# EAGLE design radencoder_links (EAGLE 7.6.0)
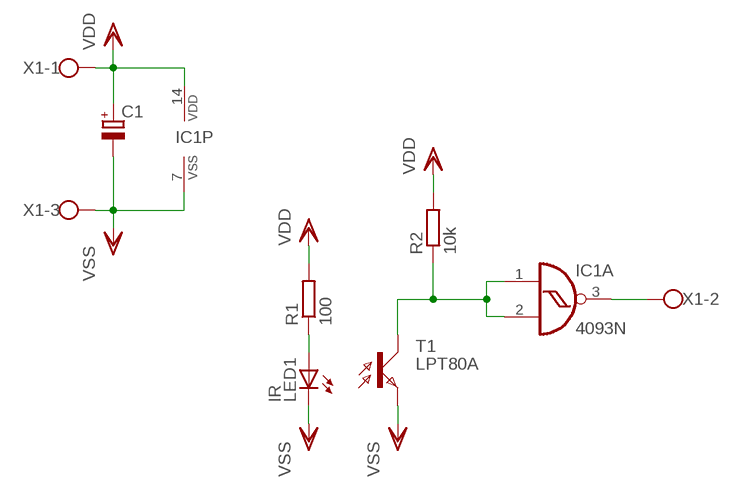
[diagram p0: schematic, sheet 1]

## Parts
C1  CPOL-EUE5-10.5  [E5-10,5]
IC1  4093N  [DIL14]
LED1  IR  LED5MM  [LED5MM]
R1  100  R-EU_0207/10  [0207/10]
R2  10k  R-EU_0207/10  [0207/10]
T1  LPT80A  [LPT80A]
X1  W237-103  [W237-103]

## Nets
N$1: IC1.3(A:O) X1.2
N$2: IC1.1(A:I0) IC1.2(A:I1) R2.1 T1.C
N$5: LED1.A R1.1
VDD: C1.+ IC1.14(P:VDD) R1.2 R2.2 X1.1
VSS: C1.- IC1.7(P:VSS) LED1.K(C) T1.E X1.3
Unconnected: IC1.4(B:O) IC1.5(B:I0) IC1.6(B:I1) IC1.8(C:I0) IC1.9(C:I1) IC1.10(C:O) IC1.11(D:O) IC1.12(D:I0) IC1.13(D:I1)

## Library data of the parts
C1 = resistor:CPOL-EU: POLARIZED CAPACITOR, European symbol
IC1 = 40xx:4093: Quad 2-input NAND schmitt trigger
LED1 = led:LED: LED OSRAM: - CHIPLED LG R971, LG N971, LY N971, LG Q971, LY Q971, LO R971, LY R971 LH N974, LH R974 LS Q976, LO Q976, LY Q976 LO Q996 - Hyper CHIPLED LW Q18S LB Q993, LB Q99A, LB R99A - SideLED LS A670, LO A670, LY A670, LG A670, LP A670 LB A673, LV A673, LT A673, LW A673 LH A674 LY A675 LS A676, LA A676, LO A676, LY A676, LW A676 LS A679, LY A679, LG A679 - Hyper Micro SIDELED® LS Y876, LA Y876, LO Y876, LY Y876 LT Y87S - SmartLED LW L88C, LW L88S LB L89C, LB L89S, LG L890 LS L89K, LO L89K, LY L89K LS L896, LA L896, LO L896, LY L896 - TOPLED LS T670, LO T670, LY T670, LG T670, LP T670 LSG T670, LSP T670, LSY T670, LOP T670, LYG T670 LG T671, LOG T671, LSG T671 LB T673, LV T673, LT T673, LW T673 LH T674 LS T676, LA T676, LO T676, LY T676, LB T676, LH T676, LSB T676, LW T676 LB T67C, LV T67C, LT T67C, LS T67K, LO T67K, LY T67K, LW E67C LS E67B, LA E67B, LO E67B, LY E67B, LB E67C, LV E67C, LT E67C LW T67C LS T679, LY T679, LG T679 LS T770, LO T770, LY T770, LG T770, LP T770 LB T773, LV T773, LT T773, LW T773 LH T774 LS E675, LA E675, LY E675, LS T675 LS T776, LA T776, LO T776, LY T776, LB T776 LHGB T686 LT T68C, LB T68C - Hyper Mini TOPLED® LB M676 - Mini TOPLED Santana® LG M470 LS M47K, LO M47K, LY M47K Source: http://www.osram.convergy.de LUXEON: - LUMILED® LXK2-PW12-R00, LXK2-PW12-S00, LXK2-PW14-U00, LXK2-PW14-V00 LXK2-PM12-R00, LXK2-PM12-S00, LXK2-PM14-U00 LXK2-PE12-Q00, LXK2-PE12-R00, LXK2-PE12-S00, LXK2-PE14-T00, LXK2-PE14-U00 LXK2-PB12-K00, LXK2-PB12-L00, LXK2-PB12-M00, LXK2-PB14-N00, LXK2-PB14-P00, LXK2-PB14-Q00 LXK2-PR12-L00, LXK2-PR12-M00, LXK2-PR14-Q00, LXK2-PR14-R00 LXK2-PD12-Q00, LXK2-PD12-R00, LXK2-PD12-S00 LXK2-PH12-R00, LXK2-PH12-S00 LXK2-PL12-P00, LXK2-PL12-Q00, LXK2-PL12-R00 Source: www.luxeon.com KINGBRIGHT: KA-3528ASYC Source: www.kingbright.com
R1 R2 = rcl:R-EU_: RESISTOR, European symbol
T1 = opto-trans-siemens:LPT80A: PHOTO TRANSISTOR; OC_FARNELL: unknown; OC_NEWARK: unknown
X1 = con-wago-500:W237-103: WAGO SCREW CLAMP; MPN: 237-103; OC_FARNELL: unknown; OC_NEWARK: 18M7116

## Board
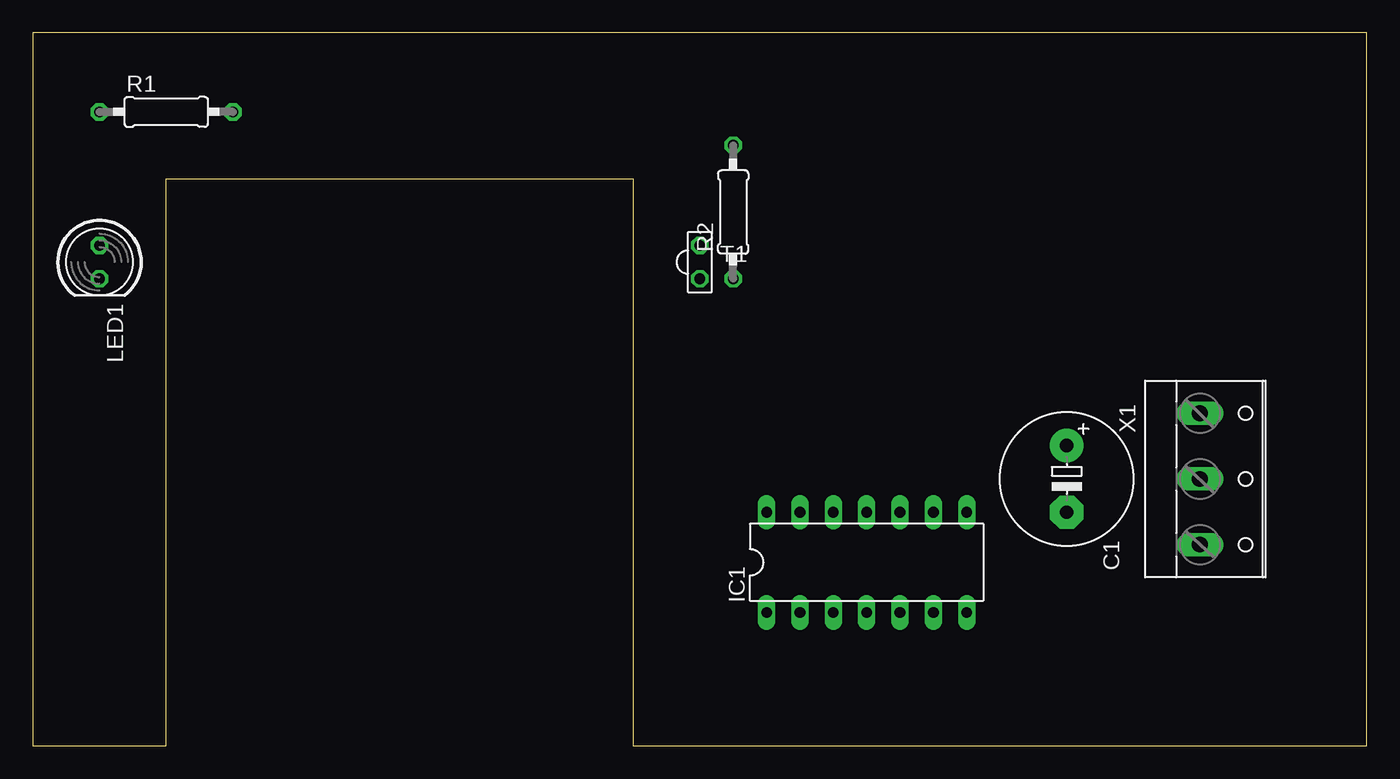
[diagram p1: board, top side]
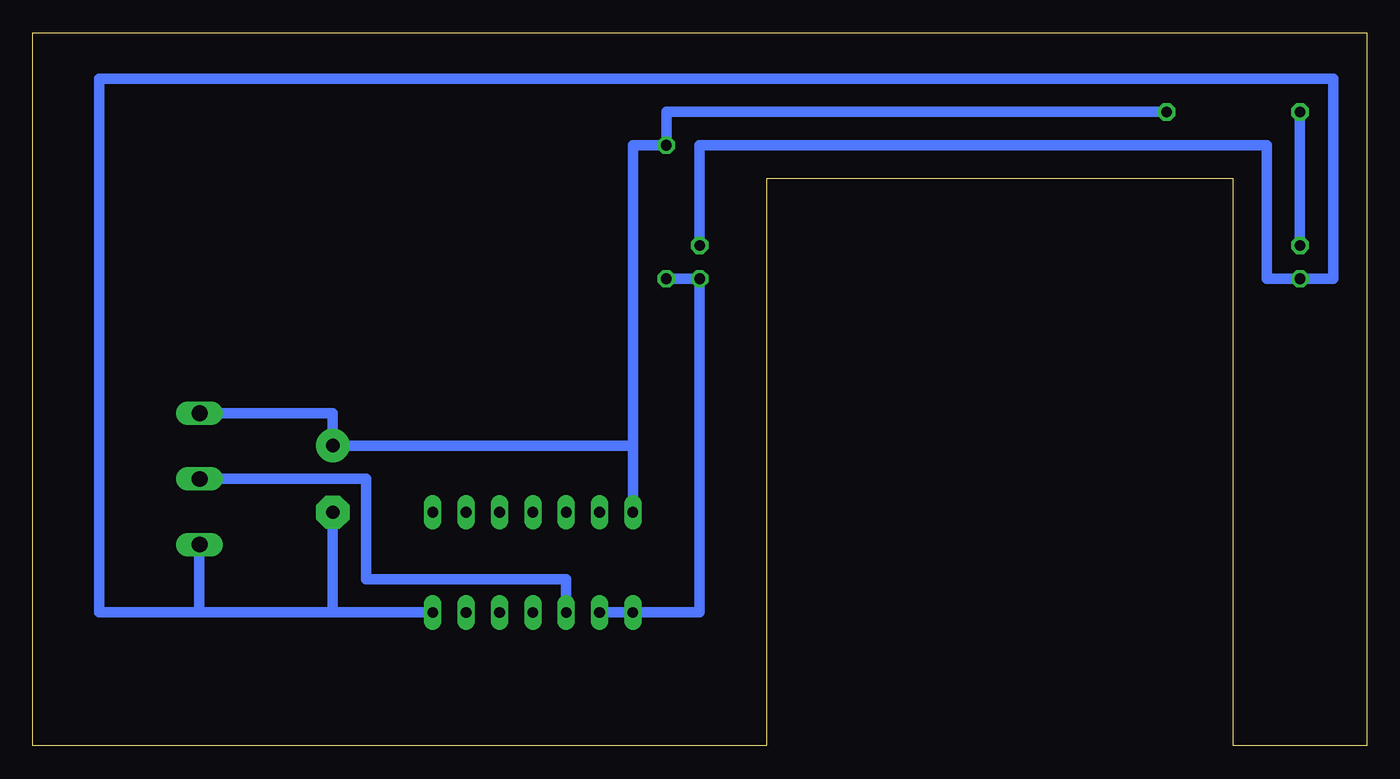
[diagram p2: board, bottom side, seen from below]

Size 101.58 x 54.28 mm. Coordinates in mm from the lower left corner, seen from the top.
Outline: 101.58,0 101.58,54.28 0,54.28 0,0 10.16,0 10.16,43.18 45.72,43.18 45.72,0 101.58,0
Copper layers (1*16): Top 0.035mm / dielectric 1.5mm / Bottom 0.035mm
Design rules "default": minimum track width 10mil, minimum drill 24mil, track to track 8mil, track to pad 8mil, pad to pad 8mil, via to via 8mil, smd to smd 8mil, copper to edge 40mil, drill to drill 8mil, minimum pad ring 10mil, minimum via ring 8mil, stop-mask expansion 4mil, vias tented up to drill 0mil, thermal gap 10mil

### Footprints (pad centres in the part's own frame; a part is rotated, then mirrored left to right if it is on the bottom)
E5-10,5 = drill 1.016 pad 2.54: + -2.54,0 | drill 1.016 pad 2.54 octagon: - 2.54,0
DIL14 = drill 0.813 long: 1 -7.62,-3.81; 2 -5.08,-3.81; 3 -2.54,-3.81; 4 0,-3.81; 5 2.54,-3.81; 6 5.08,-3.81; 7 7.62,-3.81; 8 7.62,3.81; 9 5.08,3.81; 10 2.54,3.81; 11 0,3.81; 12 -2.54,3.81; 13 -5.08,3.81; 14 -7.62,3.81
LED5MM = drill 0.813 octagon: A -1.27,0; K 1.27,0
0207/10 = drill 0.813 octagon: 1 -5.08,0; 2 5.08,0
LPT80A = drill 0.813 octagon: C 0,-1.27; E 0,1.27
W237-103 = drill 1.194 long: 1 -5,-1.29; 2 0,-1.29; 3 5,-1.29

### Placement (x,y rotation side)
C1  78.74,20.32 270 top
IC1  63.5,13.97 0 top
LED1  5.08,36.83 270 top
R1  10.16,48.26 0 top
R2  53.34,40.64 90 top
T1  50.8,36.83 0 top
X1  90.17,20.32 270 top

### Tracks (layer width: path | path; a pad name or v marks a point on that pad's centre or on a via)
N$1
  Bottom 0.8: IC1.3 60.96,12.7 76.2,12.7 76.2,20.32 X1.2 88.9,20.32
N$2
  Bottom 0.8: IC1.2 IC1.1 50.8,10.16 T1.C R2.1
N$5
  Bottom 0.8: R1.1 LED1.A
VDD
  Bottom 0.8: X1.1 78.74,25.32 C1.+ 55.88,22.86 | R1.2 53.34,48.26 R2.2 55.88,45.72 55.88,22.86 | 55.88,22.86 IC1.14
VSS
  Bottom 0.8: X1.3 88.9,15.32 88.9,10.16 | 88.9,10.16 78.74,10.16 | 78.74,10.16 IC1.7 | C1.- 78.74,10.16 | 88.9,10.16 96.52,10.16 96.52,50.8 2.54,50.8 2.54,35.56 LED1.K 7.62,35.56 7.62,45.72 50.8,45.72 T1.E